# Altium project DB-STM32F103CBTx.PrjPcb
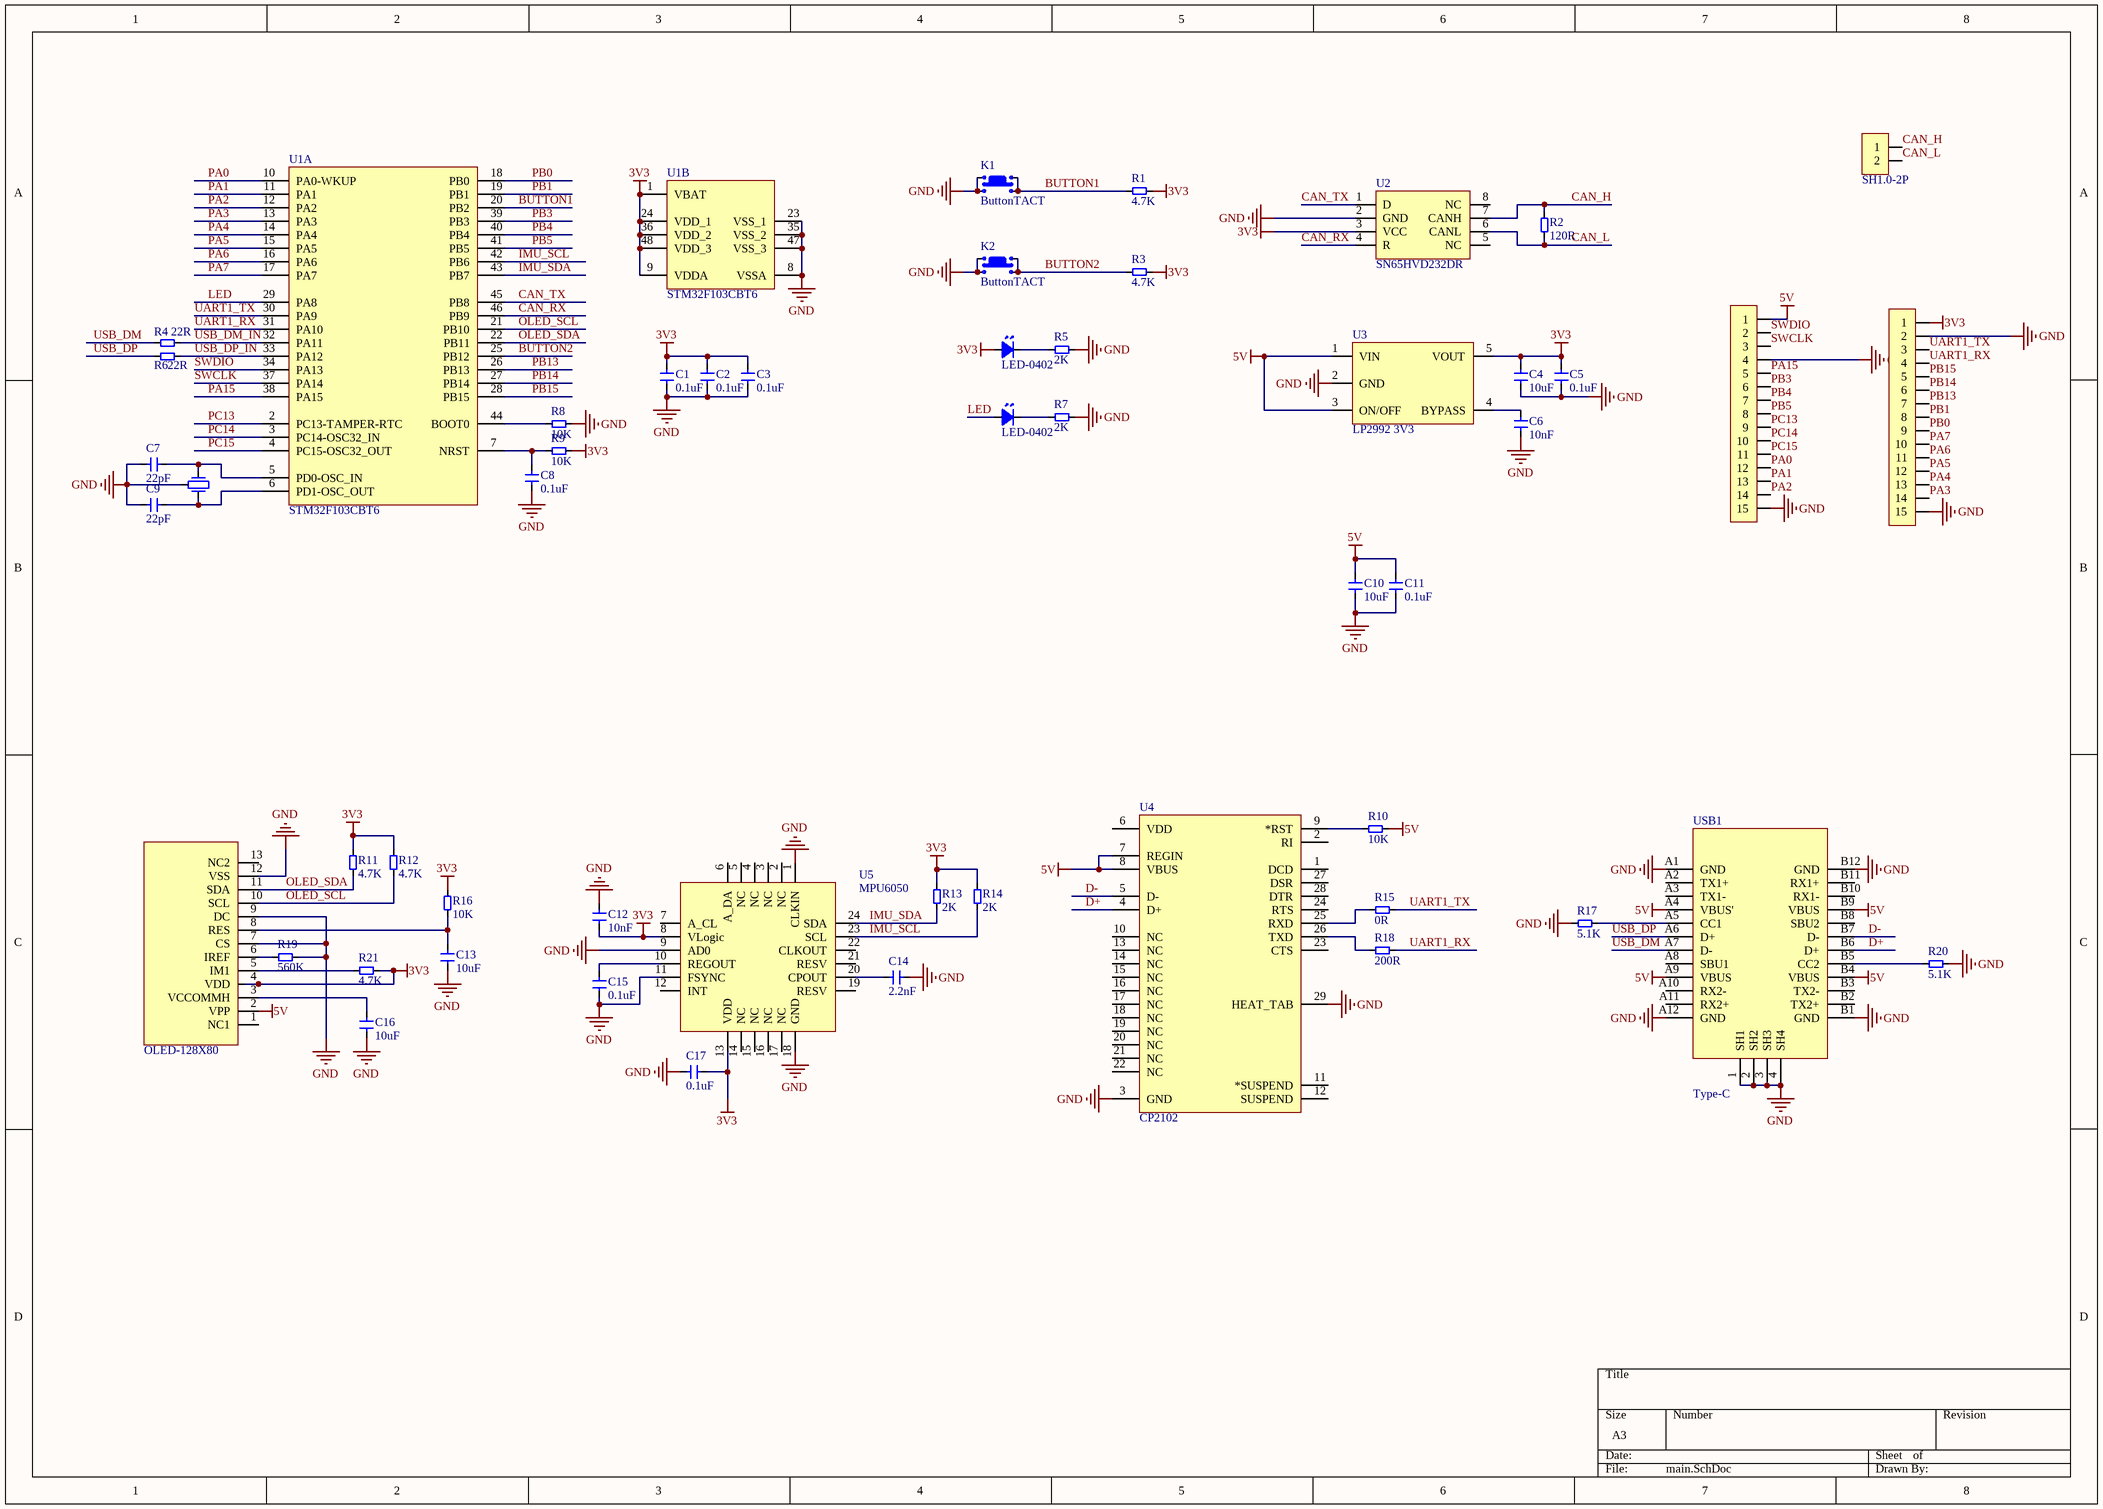
[diagram p0: main.SchDoc]
1 sheet, 53 parts. Net scope: global (net labels, ports and power ports of the same name join across sheets).
Board file: DB-STM32F103CBTx.PcbDoc

## Sheet main.SchDoc
size A3; SheetNumber: 1; SheetTotal: 1

### Parts
1  OLED-128X80  [OLED-128X80]
*1  SH1.0-2P  [SH1.0-2P]
*2  LED-0402  [LED_0402_YELLOW]
*3  LED-0402  [LED_0402_YELLOW]
*4  OSC-8MHz-3P  [晶振_3P]  (value not drawn)
*5  HDR2.54-15P  [HDR2.54-15P]  (value not drawn)
*6  HDR2.54-15P  [HDR2.54-15P]  (value not drawn)
C1  0.1uF  [CAP_0402]
C2  0.1uF  [CAP_0402]
C3  0.1uF  [CAP_0402]
C4  10uF  [CAP_0402]
C5  0.1uF  [CAP_0402]
C6  10nF  [CAP_0402]
C7  22pF  [CAP_0402]
C8  0.1uF  [CAP_0402]
C9  22pF  [CAP_0402]
C10  10uF  [CAP_0402]
C11  0.1uF  [CAP_0402]
C12  10nF  [CAP_0402]
C13  10uF  [CAP_0402]
C14  2.2nF  [CAP_0402]
C15  0.1uF  [CAP_0402]
C16  10uF  [CAP_0402]
C17  0.1uF  [CAP_0402]
K1  ButtonTACT  [ButtonTACT_3.5*3.55_90]
K2  ButtonTACT  [ButtonTACT_3.5*3.55_90]
R1  4.7K  [RES_0402]
R2  120R  [RES_0402]
R3  4.7K  [RES_0402]
R4  22R  [RES_0402]
R5  2K  [RES_0402]
R6  22R  [RES_0402]
R7  2K  [RES_0402]
R8  10K  [RES_0402]
R9  10K  [RES_0402]
R10  10K  [RES_0402]
R11  4.7K  [RES_0402]
R12  4.7K  [RES_0402]
R13  2K  [RES_0402]
R14  2K  [RES_0402]
R15  0R  [RES_0402]
R16  10K  [RES_0402]
R17  5.1K  [RES_0402]
R18  200R  [RES_0402]
R19  560K  [RES_0402]
R20  5.1K  [RES_0402]
R21  4.7K  [RES_0402]
U1  STM32F103CBT6  [LQFP-48]  (parts A,B of 2)
U2  SN65HVD232DR  [SO-8]
U3  LP2992 3V3  [SOT23-5]
U4  CP2102  [QFN-28]
U5  MPU6050  [QFN-24]
USB1  Type-C  [Type-C-TOP-16]

### Nets
3V3: 1.4(VDD) *2.1 *6.1 C1.2 C2.2 C3.2 C4.2 C5.2 C12.1 C17.1 R1.2 R3.2 R9.2 R11.1 R12.1 R13.2 R14.1 R16.2 R21.2 U1.1(VBAT) U1.9(VDDA) U1.24(VDD_1) U1.36(VDD_2) U1.48(VDD_3) U2.3(VCC) U3.5(VOUT) U5.8(VLogic) U5.13(VDD)
5V: 1.2(VPP) *5.1 C10.2 C11.2 R10.2 U3.1(VIN) U3.3(ON/OFF) U4.7(REGIN) U4.8(VBUS) USB1.A4(VBUS') USB1.A9(VBUS) USB1.B4(VBUS) USB1.B9(VBUS)
GND: 1.7(CS) 1.9(DC) 1.12(VSS) *4.2 *5.4 *5.15 *6.2 *6.15 C1.1 C2.1 C3.1 C4.1 C5.1 C6.1 C7.2 C8.2 C9.2 C10.1 C11.1 C12.2 C13.1 C14.1 C15.2 C16.1 C17.2 K1.1 K1.3 K2.1 K2.3 R5.2 R7.2 R8.2 R17.1 R19.2 R20.2 U1.8(VSSA) U1.23(VSS_1) U1.35(VSS_2) U1.47(VSS_3) U2.2(GND) U3.2(GND) U4.3(GND) U4.29(HEAT_TAB) U5.1(CLKIN) U5.9(AD0) U5.11(FSYNC) U5.18(GND) USB1.1(SH1) USB1.2(SH2) USB1.3(SH3) USB1.4(SH4) USB1.A1(GND) USB1.A12(GND) USB1.B1(GND) USB1.B12(GND)
BUTTON1: K1.2 K1.4 R1.1 U1.20(PB2)
BUTTON2: K2.2 K2.4 R3.1 U1.25(PB12)
CAN_H: *1.1 R2.2 U2.7(CANH)
CAN_L: *1.2 R2.1 U2.6(CANL)
CAN_RX: U1.46(PB9) U2.4(R)
CAN_TX: U1.45(PB8) U2.1(D)
D+: U4.4(D+) USB1.B6(D+)
D-: U4.5(D-) USB1.B7(D-)
IMU_SCL: R14.2 U1.42(PB6) U5.23(SCL)
IMU_SDA: R13.1 U1.43(PB7) U5.24(SDA)
LED: *3.1 U1.29(PA8)
OLED_SCL: 1.10(SCL) R12.2 U1.21(PB10)
OLED_SDA: 1.11(SDA) R11.2 U1.22(PB11)
PA0: *5.12 U1.10(PA0-WKUP)
PA1: *5.13 U1.11(PA1)
PA2: *5.14 U1.12(PA2)
PA3: *6.14 U1.13(PA3)
PA4: *6.13 U1.14(PA4)
PA5: *6.12 U1.15(PA5)
PA6: *6.11 U1.16(PA6)
PA7: *6.10 U1.17(PA7)
PA15: *5.5 U1.38(PA15)
PB0: *6.9 U1.18(PB0)
PB1: *6.8 U1.19(PB1)
PB3: *5.6 U1.39(PB3)
PB4: *5.7 U1.40(PB4)
PB5: *5.8 U1.41(PB5)
PB13: *6.7 U1.26(PB13)
PB14: *6.6 U1.27(PB14)
PB15: *6.5 U1.28(PB15)
PC13: *5.9 U1.2(PC13-TAMPER-RTC)
PC14: *5.10 U1.3(PC14-OSC32_IN)
PC15: *5.11 U1.4(PC15-OSC32_OUT)
SWCLK: *5.3 U1.37(PA14)
SWDIO: *5.2 U1.34(PA13)
UART1_RX: *6.4 R18.2 U1.31(PA10)
UART1_TX: *6.3 R15.2 U1.30(PA9)
USB_DM: R4.1 USB1.A7(D-)
USB_DM_IN: R4.2 U1.32(PA11)
USB_DP: R6.1 USB1.A6(D+)
USB_DP_IN: R6.2 U1.33(PA12)
Net1_3: 1.3(VCCOMMH) C16.2
Net1_5: 1.5(IM1) R21.1
Net1_6: 1.6(IREF) R19.1
Net1_8: 1.8(RES) C13.2 R16.1
Net*2_2: *2.2 R5.1
Net*3_2: *3.2 R7.1
Net*4_1: *4.1 C9.1 U1.6(PD1-OSC_OUT)
Net*4_3: *4.3 C7.1 U1.5(PD0-OSC_IN)
NetC6_2: C6.2 U3.4(BYPASS)
NetC8_1: C8.1 R9.1 U1.7(NRST)
NetC14_2: C14.2 U5.20(CPOUT)
NetC15_1: C15.1 U5.10(REGOUT)
NetR8_1: R8.1 U1.44(BOOT0)
NetR10_1: R10.1 U4.9(*RST)
NetR15_1: R15.1 U4.25(RXD)
NetR17_2: R17.2 USB1.A5(CC1)
NetR18_1: R18.1 U4.26(TXD)
NetR20_1: R20.1 USB1.B5(CC2)

Not connected (* = marked no-connect by the designer): 1 1(NC1) 13(NC2); U2 5(NC) 8(NC); U4 1(DCD) 2(RI) 6(VDD) 10(NC) 11(*SUSPEND) 12(SUSPEND) 13(NC) 14(NC) 15(NC) 16(NC) 17(NC) 18(NC) 19(NC) 20(NC) 21(NC) 22(NC) 23(CTS) 24(RTS) 27(DSR) 28(DTR); U5 2(NC) 3(NC) 4(NC) 5(NC) 6(A_DA) 7(A_CL) 12(INT) 14(NC) 15(NC) 16(NC) 17(NC) 19(RESV) 21(RESV) 22(CLKOUT); USB1 A2(TX1+) A3(TX1-) A8(SBU1) A10(RX2-) A11(RX2+) B2(TX2+) B3(TX2-) B8(SBU2) B10(RX1-) B11(RX1+)

### Library data of the parts
1 = OLED-128X80: SH1107
C1-C17 = 电容-0402: Cap-0402
R1-R21 = 电阻-0402: Res-0402
U2 = SN65HVD232DR: CAN通信
U3 = LP2992 3V3: LDO
U5 = MPU6050: 六轴陀螺仪